# Altium schematic sheet led_light.SchDoc
size A4
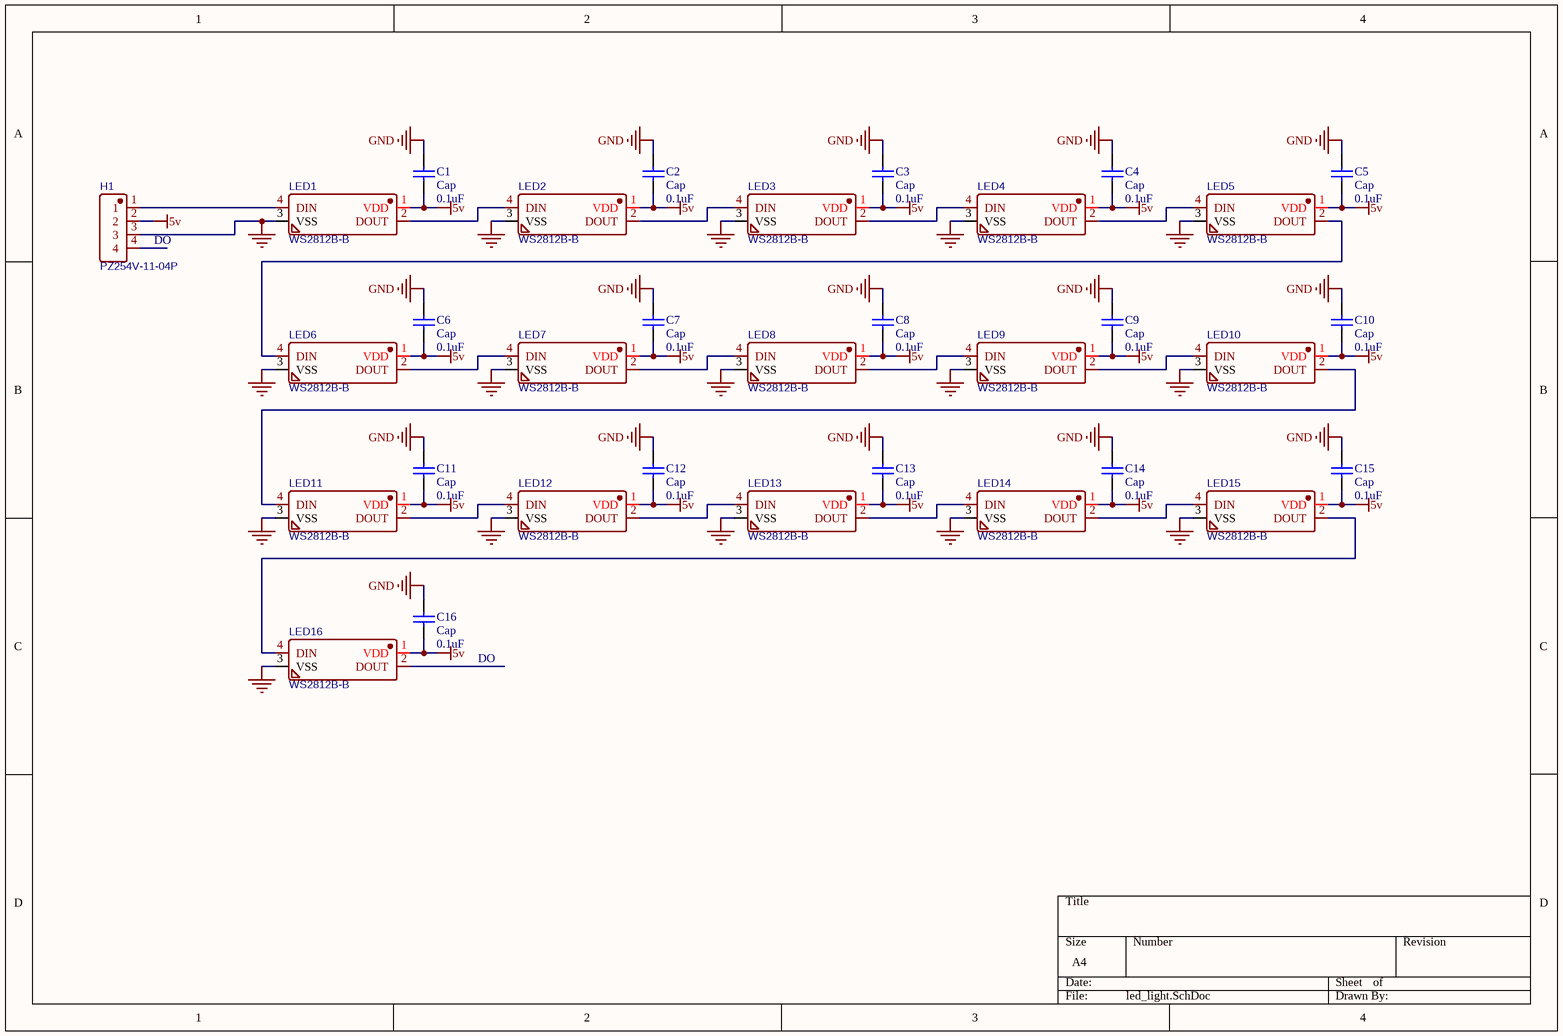
[diagram p0: led_light.SchDoc]

## Parts
C1  Cap  value 0.1uF  [C0603]
C2  Cap  value 0.1uF  [C0603]
C3  Cap  value 0.1uF  [C0603]
C4  Cap  value 0.1uF  [C0603]
C5  Cap  value 0.1uF  [C0603]
C6  Cap  value 0.1uF  [C0603]
C7  Cap  value 0.1uF  [C0603]
C8  Cap  value 0.1uF  [C0603]
C9  Cap  value 0.1uF  [C0603]
C10  Cap  value 0.1uF  [C0603]
C11  Cap  value 0.1uF  [C0603]
C12  Cap  value 0.1uF  [C0603]
C13  Cap  value 0.1uF  [C0603]
C14  Cap  value 0.1uF  [C0603]
C15  Cap  value 0.1uF  [C0603]
C16  Cap  value 0.1uF  [C0603]
H1  PZ254V-11-04P  [HDR-TH_4P-P2.54-V-M]
LED1  WS2812B-B  [LED-SMD_4P-L5.0-W5.0-TL_WS2812B-B]
LED2  WS2812B-B  [LED-SMD_4P-L5.0-W5.0-TL_WS2812B-B]
LED3  WS2812B-B  [LED-SMD_4P-L5.0-W5.0-TL_WS2812B-B]
LED4  WS2812B-B  [LED-SMD_4P-L5.0-W5.0-TL_WS2812B-B]
LED5  WS2812B-B  [LED-SMD_4P-L5.0-W5.0-TL_WS2812B-B]
LED6  WS2812B-B  [LED-SMD_4P-L5.0-W5.0-TL_WS2812B-B]
LED7  WS2812B-B  [LED-SMD_4P-L5.0-W5.0-TL_WS2812B-B]
LED8  WS2812B-B  [LED-SMD_4P-L5.0-W5.0-TL_WS2812B-B]
LED9  WS2812B-B  [LED-SMD_4P-L5.0-W5.0-TL_WS2812B-B]
LED10  WS2812B-B  [LED-SMD_4P-L5.0-W5.0-TL_WS2812B-B]
LED11  WS2812B-B  [LED-SMD_4P-L5.0-W5.0-TL_WS2812B-B]
LED12  WS2812B-B  [LED-SMD_4P-L5.0-W5.0-TL_WS2812B-B]
LED13  WS2812B-B  [LED-SMD_4P-L5.0-W5.0-TL_WS2812B-B]
LED14  WS2812B-B  [LED-SMD_4P-L5.0-W5.0-TL_WS2812B-B]
LED15  WS2812B-B  [LED-SMD_4P-L5.0-W5.0-TL_WS2812B-B]
LED16  WS2812B-B  [LED-SMD_4P-L5.0-W5.0-TL_WS2812B-B]

## Nets
5v: C1.1 C2.1 C3.1 C4.1 C5.1 C6.1 C7.1 C8.1 C9.1 C10.1 C11.1 C12.1 C13.1 C14.1 C15.1 C16.1 H1.2 LED1.1(VDD) LED2.1(VDD) LED3.1(VDD) LED4.1(VDD) LED5.1(VDD) LED6.1(VDD) LED7.1(VDD) LED8.1(VDD) LED9.1(VDD) LED10.1(VDD) LED11.1(VDD) LED12.1(VDD) LED13.1(VDD) LED14.1(VDD) LED15.1(VDD) LED16.1(VDD)
GND: C1.2 C2.2 C3.2 C4.2 C5.2 C6.2 C7.2 C8.2 C9.2 C10.2 C11.2 C12.2 C13.2 C14.2 C15.2 C16.2 H1.3 LED1.3(VSS) LED2.3(VSS) LED3.3(VSS) LED4.3(VSS) LED5.3(VSS) LED6.3(VSS) LED7.3(VSS) LED8.3(VSS) LED9.3(VSS) LED10.3(VSS) LED11.3(VSS) LED12.3(VSS) LED13.3(VSS) LED14.3(VSS) LED15.3(VSS) LED16.3(VSS)
NetH1_1: H1.1 LED1.4(DIN)
NetLED1_2: LED1.2(DOUT) LED2.4(DIN)
NetLED2_2: LED2.2(DOUT) LED3.4(DIN)
NetLED3_2: LED3.2(DOUT) LED4.4(DIN)
NetLED4_2: LED4.2(DOUT) LED5.4(DIN)
NetLED5_2: LED5.2(DOUT) LED6.4(DIN)
NetLED6_2: LED6.2(DOUT) LED7.4(DIN)
NetLED7_2: LED7.2(DOUT) LED8.4(DIN)
NetLED8_2: LED8.2(DOUT) LED9.4(DIN)
NetLED9_2: LED9.2(DOUT) LED10.4(DIN)
NetLED10_2: LED10.2(DOUT) LED11.4(DIN)
NetLED11_2: LED11.2(DOUT) LED12.4(DIN)
NetLED12_2: LED12.2(DOUT) LED13.4(DIN)
NetLED13_2: LED13.2(DOUT) LED14.4(DIN)
NetLED14_2: LED14.2(DOUT) LED15.4(DIN)
NetLED15_2: LED15.2(DOUT) LED16.4(DIN)

Not connected (* = marked no-connect by the designer): H1 4; LED16 2(DOUT)

## Notes on the sheet
- (near H1) DO
- DO

## Library data of the parts
C1-C16 = Cap: Capacitor; Published: 8-Jun-2000; LatestRevisionDate: 17-Jul-2002; LatestRevisionNote: Re-released for DXP Platform.; PackageReference: RAD-0.3; Publisher: Altium Limited; PackageDescription: Radial Cap, Thru-Hole; 2 Leads; 0.3 in Pin Spacing
H1 = PZ254V-11-04P_C2691448: BOM_Manufacturer: XFCN(台湾兴飞); Contributor: LCSC; BOM_Supplier: LCSC; BOM_Supplier Part: C2691448; BOM_Manufacturer Part: PZ254V-11-04P; BOM_JLCPCB Part Class: Extended Part; spicePre: H; spiceSymbolName: PZ254V-11-04P_C2691448
LED1-LED16 = WS2812B-B: BOM_Manufacturer: Worldsemi; Contributor: LCSC; BOM_Supplier: LCSC; BOM_Manufacturer Part: WS2812B-B; BOM_Supplier Part: C114586; BOM_JLCPCB Part Class: Extended Part; spicePre: L; spiceSymbolName: WS2812B-B